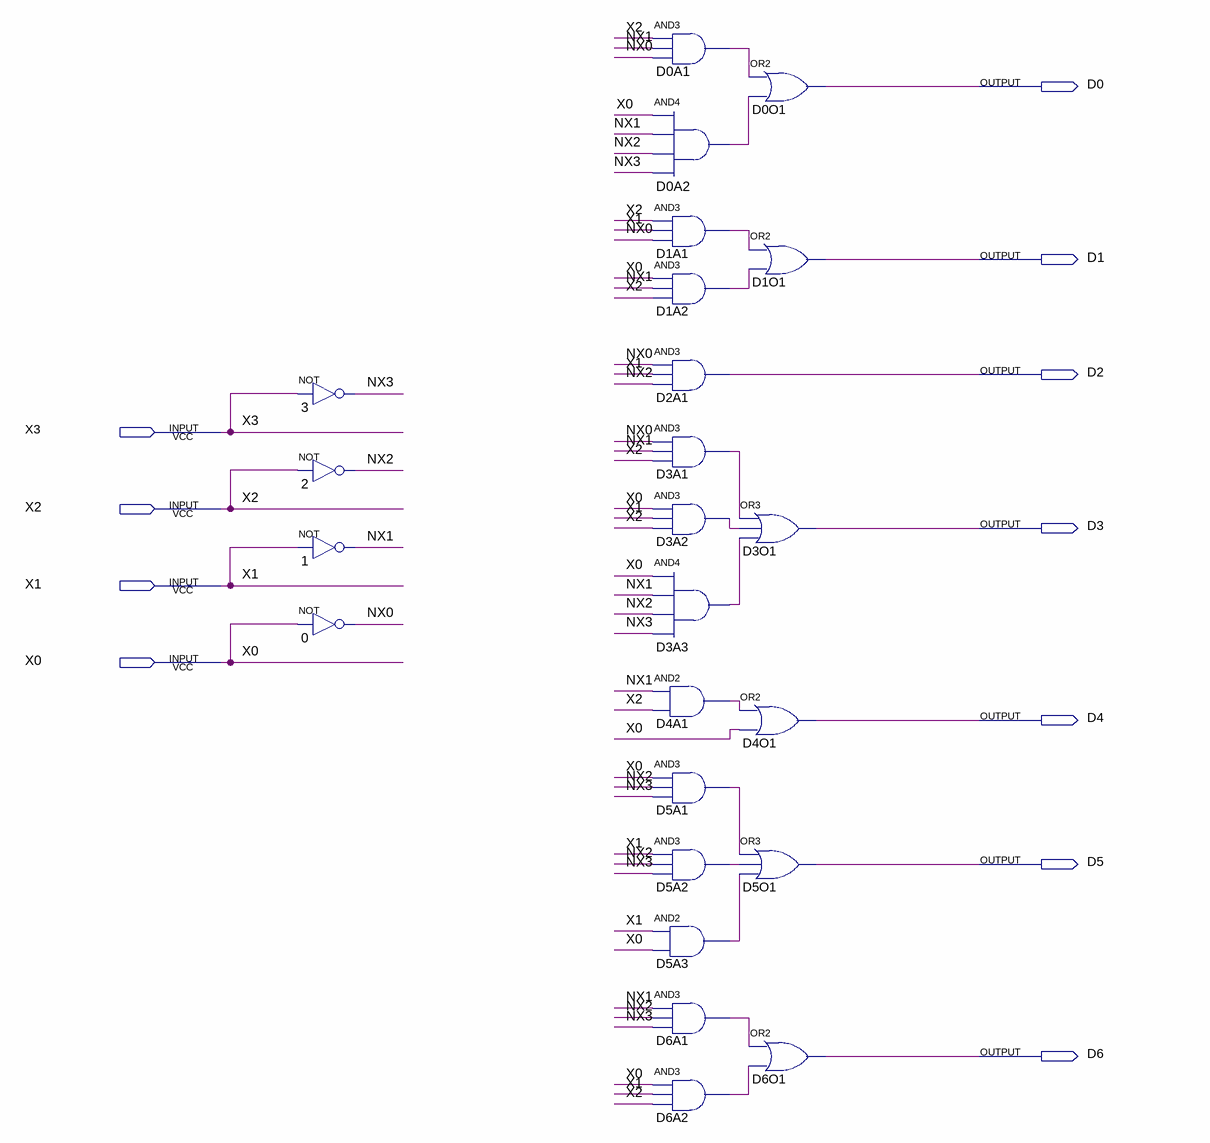
[diagram p0: schematic sheet]
// Quartus schematic Lab2SegmentDisplay.bdf as structural Verilog: 24 symbols, 11 pins
module Lab2SegmentDisplay (
  input  X3,
  input  X2,
  input  X1,
  input  X0,
  output D0,
  output D1,
  output D2,
  output D3,
  output D4,
  output D5,
  output D6
);

  wire D0A1_out, D0A2_out, D1A1_out, D1A2_out, D3A1_out, D3A2_out, D3A3_out, D4A1_out, D5A1_out, D5A2_out,
       D5A3_out, D6A1_out, D6A2_out, NX0, NX1, NX2, NX3;

  not u_3 (NX3, X3);
  not u_2 (NX2, X2);
  not u_1 (NX1, X1);
  not u_0 (NX0, X0);
  and D0A1 (D0A1_out, X2, NX1, NX0);
  and D0A2 (D0A2_out, X0, NX1, NX2, NX3);
  and D1A1 (D1A1_out, X2, X1, NX0);
  and D1A2 (D1A2_out, X0, NX1, X2);
  and D2A1 (D2, NX0, X1, NX2);
  and D3A1 (D3A1_out, NX0, NX1, X2);
  and D3A2 (D3A2_out, X0, X1, X2);
  and D3A3 (D3A3_out, X0, NX1, NX2, NX3);
  and D4A1 (D4A1_out, NX1, X2);
  and D5A1 (D5A1_out, X0, NX2, NX3);
  and D5A2 (D5A2_out, X1, NX2, NX3);
  and D5A3 (D5A3_out, X1, X0);
  and D6A1 (D6A1_out, NX1, NX2, NX3);
  and D6A2 (D6A2_out, X0, X1, X2);
  or D0O1 (D0, D0A1_out, D0A2_out);
  or D1O1 (D1, D1A1_out, D1A2_out);
  or D3O1 (D3, D3A1_out, D3A2_out, D3A3_out);
  or D4O1 (D4, D4A1_out, X0);
  or D5O1 (D5, D5A1_out, D5A2_out, D5A3_out);
  or D6O1 (D6, D6A1_out, D6A2_out);
endmodule
